# EAGLE design T STorM32 NT motor v42ECg4 000 (EAGLE 7.5.0)
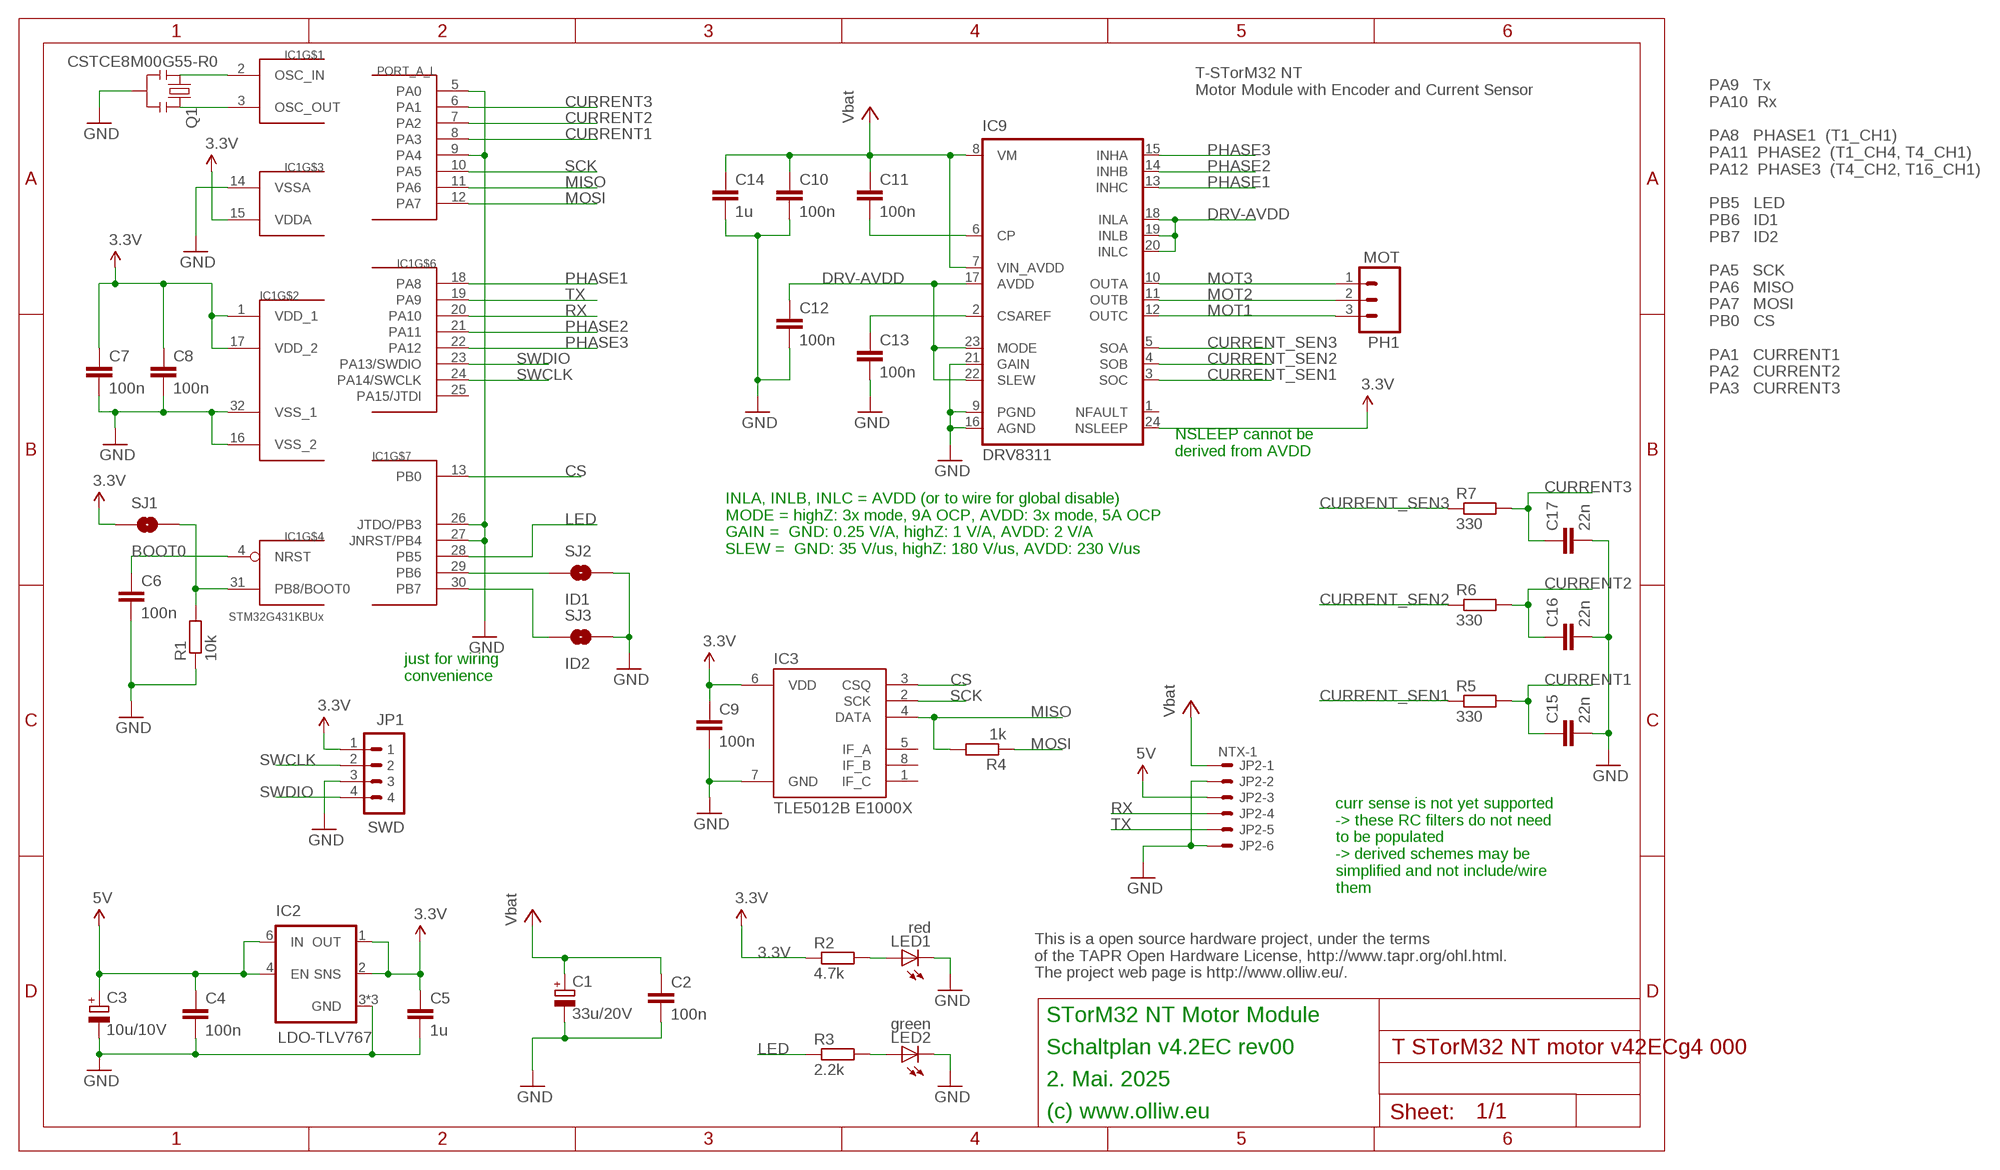
[diagram p0: schematic, sheet 1]

## Parts
C1  33u/20V  CPOL-EUSMCC  [SMC_C]
C2  100n  C-EUC0603  [C0603]
C3  10u/10V  CPOL-EUSMCB  [SMC_B]
C4  100n  C-EUC0603  [C0603]
C5  1u  C-EUC0603  [C0603]
C6  100n  C-EUC0402  [C0402]
C7  100n  C-EUC0402  [C0402]
C8  100n  C-EUC0402  [C0402]
C9  100n  C-EUC0402  [C0402]
C10  100n  C-EUC0402  [C0402]
C11  100n  C-EUC0402  [C0402]
C12  100n  C-EUC0402  [C0402]
C13  100n  C-EUC0402  [C0402]
C14  1u  C-EUC0603  [C0603]
C15  22n  C-EUC0402  [C0402]
C16  22n  C-EUC0402  [C0402]
C17  22n  C-EUC0402  [C0402]
IC1  STM32G431KBUx  STM32G4X1KX  [UFQFPN32]
IC2  LDO-TLV767  [WSON-6-2X2]
IC3  TLE5012B E1000X  TLE5012B  [SO08]
IC9  DRV8311  [QFN(WQFN)24-3X3-DRV8311]
JP1  SWD  P4X1_1P27-OCT_BILEX  [4X1_1P27_OCT_BILEX]
JP2  NTX-1  SM06B-SRSS-TB  [SM06B-SRSS-TB]
LED1  red  LEDCHIPLED_0603  [CHIPLED_0603]
LED2  green  LEDCHIPLED_0603  [CHIPLED_0603]
PH1  MOT  M031X03_NO_SILK  [1X03_NO_SILK]
Q1  CSTCE8M00G55-R0  RESONATORSMD  [RESONATOR-SMD]
R1  10k  R-EU_R0402  [R0402]
R2  4.7k  R-EU_R0402  [R0402]
R3  2.2k  R-EU_R0402  [R0402]
R4  1k  R-EU_R0402  [R0402]
R5  330  R-EU_R0402  [R0402]
R6  330  R-EU_R0402  [R0402]
R7  330  R-EU_R0402  [R0402]
SJ1  BOOT0  SOLDERJUMPERNO  [SJ_2S-NO]
SJ2  ID1  SOLDERJUMPERNO  [SJ_2S-NO]
SJ3  ID2  SOLDERJUMPERNO  [SJ_2S-NO]

## Nets
3.3V: C5.1 C7.1 C8.1 C9.1 IC1.1(VDD_1) IC1.15(VDDA) IC1.17(VDD_2) IC2.1(OUT) IC2.2(SNS) IC3.6(VDD) IC9.24(NSLEEP) JP1.1 R2.1 SJ1.1
5V: C3.+ C4.1 IC2.4(EN) IC2.6(IN) JP2.3
CS: IC1.13(PB0) IC3.3(CSQ)
CURRENT1: C15.1 IC1.8(PA3) R5.2
CURRENT2: C16.1 IC1.7(PA2) R6.2
CURRENT3: C17.1 IC1.6(PA1) R7.2
CURRENT_SEN1: IC9.3(SOC) R5.1
CURRENT_SEN2: IC9.4(SOB) R6.1
CURRENT_SEN3: IC9.5(SOA) R7.1
DRV-AVDD: C12.1 IC9.17(AVDD) IC9.18(INLA) IC9.19(INLB) IC9.20(INLC) IC9.22(SLEW) IC9.23(MODE)
DRV-CP: C11.2 IC9.6(CP)
DRV-CSAREF: C13.1 IC9.2(CSAREF)
GND: C1.- C2.2 C3.- C4.2 C5.2 C6.2 C7.2 C8.2 C9.2 C10.2 C12.2 C13.2 C14.2 C15.2 C16.2 C17.2 IC1.5(PA0) IC1.9(PA4) IC1.14(VSSA) IC1.16(VSS_2) IC1.26(JTDO/PB3) IC1.27(JNRST/PB4) IC1.32(VSS_1) IC2.3(GND) IC2.5(GND) IC2.7(GND) IC3.7(GND) IC9.9(PGND) IC9.16(AGND) IC9.21(GAIN) JP1.3 JP2.2 JP2.6 LED1.C LED2.C Q1.2 R1.1 SJ2.2 SJ3.2
ID1: IC1.29(PB6) SJ2.1
ID2: IC1.30(PB7) SJ3.1
LED: IC1.28(PB5) R3.1
MISO: IC1.11(PA6) IC3.4(DATA) R4.2
MOSI: IC1.12(PA7) R4.1
MOT1: IC9.12(OUTC) PH1.3
MOT2: IC9.11(OUTB) PH1.2
MOT3: IC9.10(OUTA) PH1.1
N$7: C6.1 IC1.4(NRST)
N$8: IC1.31(PB8/BOOT0) R1.2 SJ1.2
N$9: IC1.2(OSC_IN) Q1.1
N$10: IC1.3(OSC_OUT) Q1.3
N$11: LED1.A R2.2
N$12: LED2.A R3.2
PHASE1: IC1.18(PA8) IC9.13(INHC)
PHASE2: IC1.21(PA11) IC9.14(INHB)
PHASE3: IC1.22(PA12) IC9.15(INHA)
RX: IC1.20(PA10) JP2.4
SCK: IC1.10(PA5) IC3.2(SCK)
SWCLK: IC1.24(PA14/SWCLK) JP1.2
SWDIO: IC1.23(PA13/SWDIO) JP1.4
TX: IC1.19(PA9) JP2.5
VBAT: C1.+ C2.1 C10.1 C11.1 C14.1 IC9.7(VIN_AVDD) IC9.8(VM) JP2.1 ; supply symbol labelled Vbat
Unconnected: IC1.25(PA15/JTDI) IC3.1(IF_C) IC3.5(IF_A) IC3.8(IF_B) IC9.1(NFAULT)

## Notes on the sheet
- PA9   Tx
  PA10  Rx
  
  PA8   PHASE1  (T1_CH1)
  PA11  PHASE2  (T1_CH4, T4_CH1)
  PA12  PHASE3  (T4_CH2, T16_CH1)
  
  PB5   LED
  PB6   ID1
  PB7   ID2
  
  PA5   SCK
  PA6   MISO
  PA7   MOSI
  PB0   CS
  
  PA1   CURRENT1
  PA2   CURRENT2 
  PA3   CURRENT3
- T-STorM32 NT
  Motor Module with Encoder and Current Sensor
- NSLEEP cannot be
  derived from AVDD
- INLA, INLB, INLC = AVDD (or to wire for global disable)
  MODE = highZ: 3x mode, 9A OCP, AVDD: 3x mode, 5A OCP
  GAIN =  GND: 0.25 V/A, highZ: 1 V/A, AVDD: 2 V/A
  SLEW =  GND: 35 V/us, highZ: 180 V/us, AVDD: 230 V/us
- just for wiring
  convenience
- curr sense is not yet supported
  -> these RC filters do not need
  to be populated
  -> derived schemes may be
  simplified and not include/wire
  them
- This is a open source hardware project, under the terms
  of the TAPR Open Hardware License, http://www.tapr.org/ohl.html.
  The project web page is http://www.olliw.eu/.
- STorM32 NT Motor Module
- Schaltplan v4.2EC rev00
- 2. Mai. 2025
- (c) www.olliw.eu

## Library data of the parts
C1 C3 = rcl:CPOL-EU: POLARIZED CAPACITOR, European symbol
C2 C4-C17 = rcl:C-EU: CAPACITOR, European symbol
IC1 = # stm32:STM32G4X1KX
IC2 = # stdlib:LDO-TLV767
IC3 = # stdlib:TLE5012B
IC9 = # stdlib:DRV8311
JP1 = # stdlib:P4X1_1P27
JP2 = con-jst2:?M06B-SRSS-TB: Disconnectable Crimp style connector, 1.0mm pitch 6 contacts
LED1 LED2 = led:LED: LED OSRAM: - CHIPLED LG R971, LG N971, LY N971, LG Q971, LY Q971, LO R971, LY R971 LH N974, LH R974 LS Q976, LO Q976, LY Q976 LO Q996 - Hyper CHIPLED LW Q18S LB Q993, LB Q99A, LB R99A - SideLED LS A670, LO A670, LY A670, LG A670, LP A670 LB A673, LV A673, LT A673, LW A673 LH A674 LY A675 LS A676, LA A676, LO A676, LY A676, LW A676 LS A679, LY A679, LG A679 - Hyper Micro SIDELED® LS Y876, LA Y876, LO Y876, LY Y876 LT Y87S - SmartLED LW L88C, LW L88S LB L89C, LB L89S, LG L890 LS L89K, LO L89K, LY L89K LS L896, LA L896, LO L896, LY L896 - TOPLED LS T670, LO T670, LY T670, LG T670, LP T670 LSG T670, LSP T670, LSY T670, LOP T670, LYG T670 LG T671, LOG T671, LSG T671 LB T673, LV T673, LT T673, LW T673 LH T674 LS T676, LA T676, LO T676, LY T676, LB T676, LH T676, LSB T676, LW T676 LB T67C, LV T67C, LT T67C, LS T67K, LO T67K, LY T67K, LW E67C LS E67B, LA E67B, LO E67B, LY E67B, LB E67C, LV E67C, LT E67C LW T67C LS T679, LY T679, LG T679 LS T770, LO T770, LY T770, LG T770, LP T770 LB T773, LV T773, LT T773, LW T773 LH T774 LS E675, LA E675, LY E675, LS T675 LS T776, LA T776, LO T776, LY T776, LB T776 LHGB T686 LT T68C, LB T68C - Hyper Mini TOPLED® LB M676 - Mini TOPLED Santana® LG M470 LS M47K, LO M47K, LY M47K Source: http://www.osram.convergy.de LUXEON: - LUMILED® LXK2-PW12-R00, LXK2-PW12-S00, LXK2-PW14-U00, LXK2-PW14-V00 LXK2-PM12-R00, LXK2-PM12-S00, LXK2-PM14-U00 LXK2-PE12-Q00, LXK2-PE12-R00, LXK2-PE12-S00, LXK2-PE14-T00, LXK2-PE14-U00 LXK2-PB12-K00, LXK2-PB12-L00, LXK2-PB12-M00, LXK2-PB14-N00, LXK2-PB14-P00, LXK2-PB14-Q00 LXK2-PR12-L00, LXK2-PR12-M00, LXK2-PR14-Q00, LXK2-PR14-R00 LXK2-PD12-Q00, LXK2-PD12-R00, LXK2-PD12-S00 LXK2-PH12-R00, LXK2-PH12-S00 LXK2-PL12-P00, LXK2-PL12-Q00, LXK2-PL12-R00 Source: www.luxeon.com KINGBRIGHT: KA-3528ASYC Source: www.kingbright.com
PH1 = # SparkFun2:M03: Header 3 Standard 3-pin 0.1" header. Use with straight break away headers (SKU : PRT-00116), right angle break away headers (PRT-00553), swiss pins (PRT-00743), machine pins (PRT-00117), and female headers (PRT-00115). Molex polarized connector foot print use with SKU : PRT-08232 with associated crimp pins and housings.
Q1 = # SparkFun2:RESONATOR: Resonator Small SMD resonator. This is the itty bitty 10/20MHz resonators with built in caps. CSTCE10M0G55 and CSTCE20M0V53. Footprint has been reviewed closely but hasn't been tested yet.
R1-R7 = rcl:R-EU_: RESISTOR, European symbol
SJ1-SJ3 = # SparkFun2:SOLDERJUMPER: Solder Jumper Standard SMD solder jumper. Used to automate production. Two varients : Normally Open and Normally Closed are the same, but have different paste layers. NC will have a large amount of paste and should jumper during reflow.

## Board
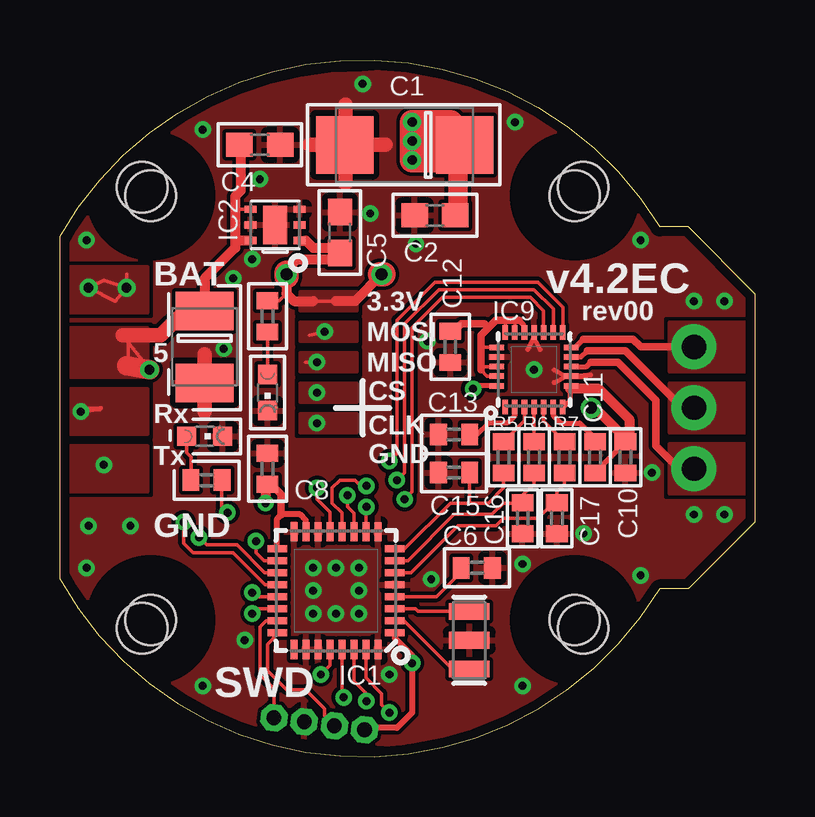
[diagram p1: board, top side]
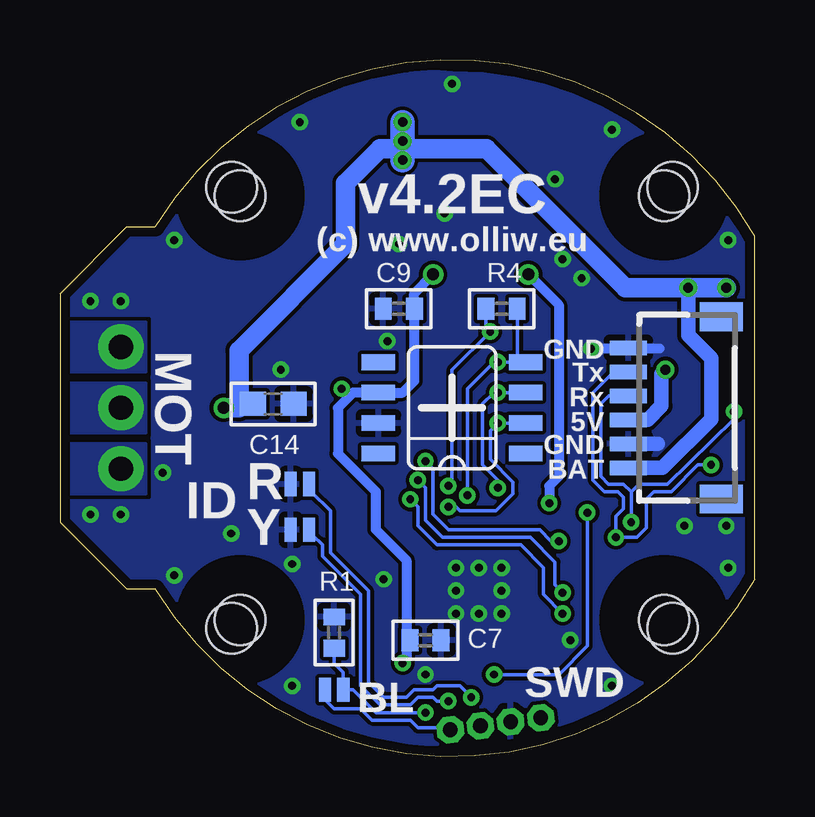
[diagram p2: board, bottom side, seen from below]

Size 28.97 x 29.02 mm. Coordinates in mm from the lower left corner, seen from the top.
Outline: 0,7.39 0,21.68 arc-119 25,22.07 26.19,22.07 28.97,19.29 28.97,9.77 26.19,6.99 25,6.99 arc-120 0,7.39
Copper layers (1*16): Top 0.0356mm / dielectric 1.5011mm / Bottom 0.0356mm
Design rules "ow-oshpark-2layer": minimum track width 6mil, minimum drill 13mil, track to track 6mil, track to pad 6mil, pad to pad 6mil, via to via 6mil, smd to smd 6mil, copper to edge 15mil, drill to drill 6mil, minimum pad ring 7mil, minimum via ring 7mil, stop-mask expansion 2.5mil, vias tented up to drill 26mil, thermal gap 10mil
Holes 2.1 mm at 3.78,23.37 21.46,23.37 21.46,5.69 3.78,5.69 3.43,23.72 21.81,23.72 21.81,5.34 3.43,5.34
tRestrict: area 1.2,20.8 to 6.3,25.9; area 1.2,3.2 to 6.3,8.2; area 18.9,3.2 to 24,8.2; area 18.9,20.8 to 24,25.9
bRestrict: area 1.2,20.8 to 6.3,25.9; area 1.2,3.2 to 6.3,8.2; area 18.9,3.2 to 24,8.2; area 18.9,20.8 to 24,25.9

### Footprints (pad centres in the part's own frame; a part is rotated, then mirrored left to right if it is on the bottom)
SMC_C = smd 2.4 x 2.4: + -2.5,0; - 2.5,0
C0603 = smd 1.1 x 1: 1 -0.85,0; 2 0.85,0
SMC_B = smd 1.6 x 2.4: + -1.5,0; - 1.5,0
C0402 = smd 0.7 x 0.9: 1 -0.65,0; 2 0.65,0
UFQFPN32 = smd 0.8 x 0.3: 1 -2.45,1.75; 2 -2.45,1.25; 3 -2.45,0.75; 4 -2.45,0.25; 5 -2.45,-0.25; 6 -2.45,-0.75; 7 -2.45,-1.25; 8 -2.45,-1.75; 17 2.45,-1.75; 18 2.45,-1.25; 19 2.45,-0.75; 20 2.45,-0.25; 21 2.45,0.25; 22 2.45,0.75; 23 2.45,1.25; 24 2.45,1.75 | smd 0.3 x 0.8: 9 -1.75,-2.45; 10 -1.25,-2.45; 11 -0.75,-2.45; 12 -0.25,-2.45; 13 0.25,-2.45; 14 0.75,-2.45; 15 1.25,-2.45; 16 1.75,-2.45; 25 1.75,2.45; 26 1.25,2.45; 27 0.75,2.45; 28 0.25,2.45; 29 -0.25,2.45; 30 -0.75,2.45; 31 -1.25,2.45; 32 -1.75,2.45
WSON-6-2X2 = smd 0.5 x 0.3: 1 -1.025,0.65; 2 -1.025,0; 3 -1.025,-0.65; 4 1.025,-0.65; 5 1.025,0; 6 1.025,0.65 | smd 1 x 1.6: 7 0,0
SO08 = smd 0.66 x 1.397: 1 0,-3.073; 2 1.27,-3.073; 3 2.54,-3.073; 4 3.81,-3.073; 5 3.81,3.073; 6 2.54,3.073; 7 1.27,3.073; 8 0,3.073
QFN(WQFN)24-3X3-DRV8311 = smd 0.6 x 0.23: 1 -1.55,1.2; 2 -1.55,0.8; 3 -1.55,0.4; 4 -1.55,0; 5 -1.55,-0.4; 6 -1.55,-0.8; 7 -1.55,-1.2; 13 1.55,-1.2; 14 1.55,-0.8; 15 1.55,-0.4; 16 1.55,0; 17 1.55,0.4; 18 1.55,0.8; 19 1.55,1.2 | smd 0.23 x 0.6: 8 -0.67,-1.55; 9 -0.27,-1.55; 10 0.13,-1.55; 11 0.53,-1.55; 12 0.93,-1.55; 20 0.93,1.55; 21 0.53,1.55; 22 0.13,1.55; 23 -0.27,1.55; 24 -0.67,1.55
4X1_1P27_OCT_BILEX = drill 0.61 pad 1.118 octagon: 1 0,0; 2 0,-1.27; 3 0,-2.54; 4 0,-3.81
SM06B-SRSS-TB = smd 0.6 x 1.55: 1 -2.5,2.975; 2 -1.5,2.975; 3 -0.5,2.975; 4 0.5,2.975; 5 1.5,2.975; 6 2.5,2.975 | smd 1.2 x 1.8: FIT@1 -3.8,-0.9; FIT@2 3.8,-0.9
CHIPLED_0603 = smd 0.8 x 0.8: A 0,-0.75; C 0,0.75
1X03_NO_SILK = drill 1.016 pad 1.88: 1 0,0; 2 2.54,0; 3 5.08,0
RESONATOR-SMD = smd 0.7 x 1.7: 1 -1.2,0; 2 0,0; 3 1.2,0
R0402 = smd 0.7 x 0.9: 1 -0.65,0; 2 0.65,0
SJ_2S-NO = smd 0.508 x 1.016: 1 -0.381,0; 2 0.381,0

### Placement (x,y rotation side)
C1  14.37,25.48 180 top
C2  15.64,22.55 180 top
C3  6.03,17.07 270 top
C4  8.33,25.48 0 top
C5  11.67,21.83 90 top
C6  17.38,7.86 0 top
C7  13.73,4.85 0 bottom
C8  8.65,11.99 90 top
C9  14.84,18.66 180 bottom
C10  23.57,12.47 270 top
C11  22.3,12.47 90 top
C12  16.27,17.07 270 top
C13  16.43,13.42 180 top
C14  20.08,14.69 0 bottom
C15  16.43,11.83 180 top
C16  19.29,9.93 270 top
C17  20.72,9.93 270 top
IC1  11.51,6.91 180 top
IC2  8.97,22.15 180 top
IC3  12.62,12.63 90 bottom
IC9  19.76,16.12 90 top
JP1  12.7,1.12 262.5 top
JP2  2.3,14.53 90 bottom
LED1  8.65,15.17 180 top
LED2  6.03,13.34 270 top
PH1  26.43,11.99 90 top
Q1  17.07,4.85 90 top
R1  17.54,5.16 270 bottom
R2  8.65,18.34 270 top
R3  6.11,11.51 180 top
R4  10.56,18.66 0 bottom
R5  18.49,12.47 270 top
R6  19.76,12.47 270 top
R7  21.03,12.47 270 top
SJ1  17.54,2.78 0 bottom
SJ2  18.97,11.36 180 bottom
SJ3  18.97,9.45 180 bottom

### Tracks (layer width: path | path; a pad name or v marks a point on that pad's centre or on a via)
3.3V  (via drill 0.33, 0.5)
  Top 0.152: 10.56,18.98 11.51,18.98 | R2.1 9.14,18.99 9.45,19.29 | IC2.2 IC2.1
  Top 0.203: IC9.24 17.35,15.45 v17.22,15.33
  Top 0.254: IC1.15 10.26,9.83 10,10.09 9.23,10.09 9.22,10.08 9.06,9.92 IC1.17 | JP1.1 12.78,1.2 14.05,1.2 14.68,1.83 v14.68,3.9 14.68,4.21 13.96,4.94 IC1.1
  Top 0.305: 9.22,10.08 9.22,10.93 8.81,11.34 C8.1 | v13.41,20.09 13.41,20.01 13.49,20.09
  Top 0.406: v13.41,20.09 12.3,18.98 11.51,18.98 | v9.44,20.09 v9.45,20.09 9.45,20.01 9.45,19.29 9.76,18.98 10.56,18.98 | C8.1 8.65,11.28 8.57,11.2 v8.57,10.56 | 9.45,20.17 9.45,20.28 9.89,20.72 11.41,20.72 C5.1 11.45,21.2 10.56,21.2 10.25,21.5 IC2.1
  Top 1.016: 9.45,20.01 9.45,20.17 | 13.33,20.09 v13.41,20.09 13.49,20.09
  Bottom 0.152: SJ1.1 17.92,2.37 17.54,1.99 16.43,1.99 15.95,1.51 14.37,1.51 14.05,1.2 12.78,1.2 JP1.1
  Bottom 0.203: v17.22,15.33 16.91,15.01
  Bottom 0.406: 14.53,4.69 14.53,8.18 15.8,9.45 15.8,11.04 17.38,12.63 17.38,14.53 16.91,15.01 16.75,15.17 IC3.6 14.68,15.17 14.21,15.64 14.21,18.5 14.19,18.64 C9.1 14.21,19.29 v13.41,20.09 | 14.53,4.69 14.53,4.05 v14.68,3.9 | 14.53,4.69 14.35,4.67 C7.1 | v8.57,10.56 8.57,11.28 8.18,11.67 8.18,18.82 v9.45,20.09
  pour Top: 10,19.37 12.38,19.37 12.38,18.58 10,18.58
5V  (via drill 0.4)
  Top 0.152: 2.85,17.62 2.85,16.35 2.78,16.28 | 2.62,17.55 v3.73,16.12 | IC2.4 7.24,22.8 7.3,22.79
  Top 0.406: 7.3,21.52 7.3,22.79 7.3,23.34 7.54,23.58 7.54,25.49 7.48,25.54 C4.1 | 7.3,21.52 7.3,21.2 6.03,19.93 6.03,18.9 5.41,18.73 C3.+ | IC2.6 7.32,21.5 7.3,21.52
  Top 0.61: C3.+ 5.16,18.5 4.21,17.55 2.62,17.55
  Top 0.813: 2.78,16.28 v3.73,16.12
  Bottom 0.61: JP2.3 4.47,14.03 3.89,14.61 3.89,15.96 v3.73,16.12
  pour Top: 0.32,17.86 3.65,17.86 3.65,15.8 0.32,15.8
CS  (via drill 0.33)
  Top 0.152: v10.72,15.17 10.56,15.33 | v10.72,11.2 10.72,10.72 11.26,10.18 IC1.13
  Bottom 0.152: IC3.3 v10.72,15.17 10.87,15.17 11.35,14.69 11.35,12.15 10.72,11.52 v10.72,11.2
  pour Top: 10,15.56 12.38,15.56 12.38,14.77 10,14.77
CURRENT1
  Top 0.152: IC1.8 14.37,8.66 16.27,10.56 17.07,10.56 | 17.07,10.56 17.86,10.56 18.49,11.2 R5.2 | C15.1 17.08,10.58 17.07,10.56
CURRENT2
  Top 0.152: IC1.7 14.51,8.16 16.43,10.09 18.02,10.09 18.49,10.56 19.27,10.56 C16.1 19.29,10.88 19.76,11.36 R6.2
CURRENT3
  Top 0.152: IC1.6 14.64,7.66 16.59,9.61 18.18,9.61 18.49,9.93 19.92,9.93 20.56,10.56 20.86,10.56 C17.1 20.72,11.04 21.03,11.36 R7.2
CURRENT_SEN1
  Top 0.152: IC9.3 19.36,13.99 R5.1
CURRENT_SEN2
  Top 0.152: IC9.4 R6.1
CURRENT_SEN3
  Top 0.152: IC9.5 20.16,13.99 R7.1
DRV-AVDD
  Top 0.152: IC9.20 17.56,17.05 17.54,17.07 | IC9.19 18.56,18.11 18.49,18.18 | IC9.18 18.96,18.19 18.97,18.18 | IC9.23 17.81,15.85 17.54,16.12 | IC9.22 17.57,16.25 17.54,16.28
  Top 0.203: IC9.17 19.36,17.95 19.13,18.18
  Top 0.305: 19.13,18.18 18.97,18.18 18.49,18.18 18.18,18.18 17.86,17.87 | 17.86,17.87 17.54,17.55 17.54,17.07 17.54,16.28 17.54,16.12 | C12.1 16.45,17.72 16.75,18.02 17.7,18.02 17.86,17.87
DRV-CP
  Top 0.203: IC9.6 20.56,14.21 20.88,13.9 21.67,13.9 22.46,13.1 C11.2 22.29,13.1
DRV-CSAREF
  Top 0.203: IC9.2 18.96,14.21 18.65,13.9 17.86,13.9 17.38,13.42 C13.1
GND  (via drill 0.33)
  Top 0.203: 19.5,16.97 19.76,17.44 20.03,16.97 | 20.61,16.11 21.09,15.85 20.61,15.58 | 21.92,15.8 21.49,15.83 21.49,15.84 21.51,15.85 22.12,15.9
  Top 0.61: 6.03,14.37 6.03,16.75 | 11.91,23.9 11.91,27.15 | 13.57,25.49 10.4,25.49
  Bottom 0.406: 3.97,16.99 6.51,16.99
  Bottom 0.61: 4.05,13.02 5.71,13.02
  other vias: 12.46,5.96 10.56,6.91 10.56,7.86 11.51,7.86 12.46,7.86 12.46,6.91 10.56,5.96 11.51,5.96 1.19,9.61 5.95,26.12 12.62,28.02 18.97,26.44 1.11,7.86 19.29,2.94 6.83,16.99 5.95,2.94 24.21,7.55 26.43,18.98 12.94,22.63 1.11,21.52 2.94,9.61 7.22,19.93 15.48,7.39 13.73,3.42 8.33,24.06 8.02,20.72 7.7,4.85 19.76,16.12 24.69,11.83 27.7,18.98 26.43,10.09 27.7,10.09 24.21,21.52 21.83,9.29 15.32,17.31 14.84,21.36 19.29,8.02
  pour Top (isolate 0.152, rank 6): 12.62,28.5 arc90 -1.35,14.53 arc90 12.62,0.56 arc90 30.64,14.53 arc90
  pour Bottom (isolate 0.152, rank 6): 12.62,28.5 arc-90 30.64,14.53 arc-90 12.62,0.56 arc-90 -1.35,14.53 arc-90
ID1  (via drill 0.33)
  Top 0.152: IC1.29 11.76,2.56 v11.83,2.47
  Bottom 0.152: SJ2.1 18.49,11.04 17.7,10.25 17.7,8.5 16.11,6.91 16.11,3.1 15.48,2.47 14.53,2.47 14.21,2.78 13.41,2.78 13.26,2.94 12.3,2.94 v11.83,2.47
ID2  (via drill 0.33)
  Top 0.152: IC1.30 12.26,3.15 12.78,2.63 v12.78,2.31
  Bottom 0.152: v12.78,2.31 13.26,2.31 13.41,2.47 14.05,2.47 14.37,2.15 15.64,2.15 16.43,2.94 16.43,6.75 18.02,8.34 18.02,8.82 18.43,9.23 SJ3.1
LED  (via drill 0.33)
  Top 0.152: v6.98,10.17 6.75,10.4 6.75,11.5 R3.1 | IC1.28 11.26,3.8 v10.87,3.42
  Bottom 0.152: v6.98,10.17 6.98,4.61 8.18,3.42 v10.87,3.42
MISO  (via drill 0.33)
  Top 0.152: v10.72,16.44 10.24,16.44 | v11.99,10.88 11.99,10.4 12.26,10.13 IC1.11
  Bottom 0.152: v11.99,10.88 11.99,15.33 10.87,16.44 v10.72,16.44 IC3.4 9.45,16.54 9.76,16.28 9.91,16.45 R4.2
  pour Top: 10,16.04 12.38,16.04 12.38,16.83 10,16.83
MOSI  (via drill 0.33)
  Top 0.152: v11.03,17.71 10.4,17.55 | v12.78,11.28 12.54,11.28 12.3,11.52 11.67,11.52 11.35,11.2 11.35,10.56 11.76,10.15 IC1.12
  Bottom 0.152: v12.78,11.28 12.62,11.44 12.62,16.12 v11.03,17.71 11.21,17.88 R4.1
  pour Top: 10,18.1 12.38,18.1 12.38,17.31 10,17.31
MOT1
  Top 0.203: IC9.12 21.49,17.05 21.83,17.39
  Top 0.305: 21.83,17.39 23.89,17.39 24.21,17.07 PH1.3
  pour Top (no thermals): 25.4,18.1 28.73,18.1 28.73,16.04 25.4,16.04
  pour Bottom (no thermals): 25.4,18.1 28.73,18.1 28.73,16.04 25.4,16.04
MOT2
  Top 0.203: IC9.11 21.72,16.65 21.99,16.91
  Top 0.305: PH1.2 25.96,14.53 23.57,16.91 21.99,16.91
  pour Top (no thermals): 25.4,15.56 28.73,15.56 28.73,13.5 25.4,13.5
  pour Bottom (no thermals): 25.4,15.56 28.73,15.56 28.73,13.5 25.4,13.5
MOT3
  Top 0.203: IC9.10 21.96,16.25 22.15,16.44
  Top 0.305: PH1.1 25.8,11.99 24.84,12.94 24.84,14.85 23.26,16.44 22.15,16.44
  pour Top (no thermals): 25.4,13.02 28.73,13.02 28.73,10.96 25.4,10.96
  pour Bottom (no thermals): 25.4,13.02 28.73,13.02 28.73,10.96 25.4,10.96
N$7
  Top 0.152: C6.1 16.75,7.71 15.7,6.66 IC1.4
N$8  (via drill 0.33)
  Top 0.152: v13.73,1.83 13.41,2.15 13.41,2.63 12.76,3.28 IC1.31
  Bottom 0.152: v13.73,1.83 15.8,1.83 16.75,2.78 SJ1.2 17.16,3.51 17.54,3.9 R1.2
N$9
  Top 0.152: Q1.1 16.36,3.65 14.35,5.66 IC1.2
N$10
  Top 0.152: Q1.3 14.93,6.05 14.82,6.16 IC1.3
N$11
  Top 0.152: R2.2 LED1.A
N$12
  Top 0.152: LED2.A 5.28,12.66 5.48,12.47 5.48,11.53 R3.2
PHASE1  (via drill 0.33)
  Top 0.152: v13.73,12.31 14.05,12.63 14.05,18.18 15.64,19.77 19.92,19.77 20.96,18.73 IC9.13 | v8.18,8.98 8.18,8.5 8.51,8.16 IC1.18
  Bottom 0.152: v13.73,12.31 13.41,11.99 13.41,10.09 12.78,9.45 8.97,9.45 8.49,8.98 v8.18,8.98
PHASE2  (via drill 0.33)
  Top 0.152: v14.05,11.52 14.37,11.83 14.37,18.02 15.8,19.45 19.76,19.45 20.56,18.65 IC9.14 | IC1.21 8.19,6.66 v8.02,6.83
  Bottom 0.152: v14.05,11.52 13.73,11.2 13.73,9.85 13.02,9.13 9.37,9.13 8.33,8.1 8.33,7.15 v8.02,6.83
PHASE3  (via drill 0.33)
  Top 0.152: v14.37,10.72 14.68,11.04 14.68,17.87 15.95,19.14 19.61,19.14 20.16,18.58 IC9.15 | IC1.22 8.22,6.16 v8.02,5.96
  Bottom 0.152: v8.02,5.96 8.81,6.75 8.81,7.86 9.76,8.82 13.26,8.82 14.05,9.61 14.05,10.4 v14.37,10.72
RX  (via drill 0.33)
  Top 0.152: v5.16,9.77 5.16,8.9 5.56,8.5 7.22,8.5 8.56,7.16 IC1.20 | v0.87,14.37 1.72,14.53 1.68,14.5
  Top 0.203: 1.24,14.48 1.68,14.5 v0.87,14.37
  Bottom 0.152: v0.87,14.37 0.87,14.06 3.65,11.36 4.84,11.36 5.16,11.04 | JP2.4 6.09,15.03 6.43,14.69 6.43,11.67 6.11,11.36 5.48,11.36 5.16,11.04 | 5.16,11.04 v5.16,9.77
  pour Top: 0.32,15.32 3.65,15.32 3.65,13.42 0.32,13.42
SCK  (via drill 0.33)
  Top 0.152: v10.72,13.9 10.56,14.06 | IC1.10 12.76,10.34 v12.78,10.4
  Bottom 0.152: IC3.2 v10.72,13.9 11.03,13.58 11.03,12.39 10.08,11.44 10.08,10.96 10.79,10.25 12.3,10.25 12.46,10.4 v12.78,10.4
  pour Top: 10,14.29 12.38,14.29 12.38,13.5 10,13.5
SWCLK
  Top 0.152: JP1.2 11.03,1.7 11.03,1.99 10.24,2.78 9.45,2.78 8.65,3.58 8.65,4.69 9.06,5.1 IC1.24
SWDIO
  Top 0.152: IC1.23 8.59,5.66 8.33,5.4 8.33,3.42 8.92,2.83 JP1.4
TX  (via drill 0.33)
  Top 0.152: v5.79,9.13 6.11,8.82 7.38,8.82 8.54,7.66 IC1.19
  Bottom 0.152: v1.83,12.15 2.38,12.15 3.49,11.04 4.21,11.04 4.52,10.72 4.52,9.53 4.92,9.13 v5.79,9.13 5.79,10.01 5.48,10.32 5.48,10.8 5.71,11.04 6.27,11.04 6.75,11.52 6.75,15.17 5.88,16.03 JP2.5
  pour Top: 0.32,12.94 3.65,12.94 3.65,11.04 0.32,11.04
VBAT  (via drill 0.4, 0.5)
  Top 0.152: v2.78,19.53 2.3,18.98 v1.19,19.53 1.83,19.85 v2.78,19.53 | v2.78,19.53 2.78,20.09 | 16.43,26.28 17.54,26.12 17.18,26.12 C1.+ | 16.75,25.01 16.59,24.85 16.11,25.8 | 16.59,25.96 16.27,26.44
  Top 0.203: C10.1 23.57,13.09 C11.1 | IC9.7 20.99,14.57 21.27,14.85 21.27,15.41 IC9.8 21.28,15.33
  Top 0.406: 16.59,22.95 16.59,22.65 C2.1 | v22.15,14.53 22.3,14.53 23.42,13.42 23.42,13.1 23.56,13.12 C10.1 23.73,13.28 23.73,14.06 22.46,15.33 21.28,15.33
  Top 0.813: 16.59,22.95 16.59,25.96
  Top 1.016: 16.43,26.28 16.27,26.44 v14.68,26.44 v14.68,25.64 | v14.68,25.64 v14.68,24.85 16.59,24.85 | 16.11,25.8 v14.68,25.64
  Bottom 0.61: v2.78,19.53 2.78,17.55 1.83,16.6 1.83,14.06 3.85,12.03 JP2.1
  Bottom 0.813: v1.19,19.53 v2.78,19.53 5.4,19.53 11.19,25.33 14.68,25.33 15.64,25.33 17.07,23.9 17.07,21.36 21.51,16.91 21.51,14.53 | C14.1 21.51,14.53 | 21.51,14.53 v22.15,14.53
  Bottom 1.016: v14.68,24.85 14.68,25.33 v14.68,26.44
  pour Top (isolate 0.254): 3.65,20.4 3.65,18.5 0.32,18.5 0.32,20.4

### Text on the board
tNames: BAT | v4.2EC | 3.3V | rev00 | MOSI | 5 | MISO | CS | Rx | CLK | Tx | GND | GND | SWD
bNames: v4.2EC | (c) www.olliw.eu | GND | Tx | Rx | 5V | MOT | GND | BAT | R | ID | Y | SWD | BL